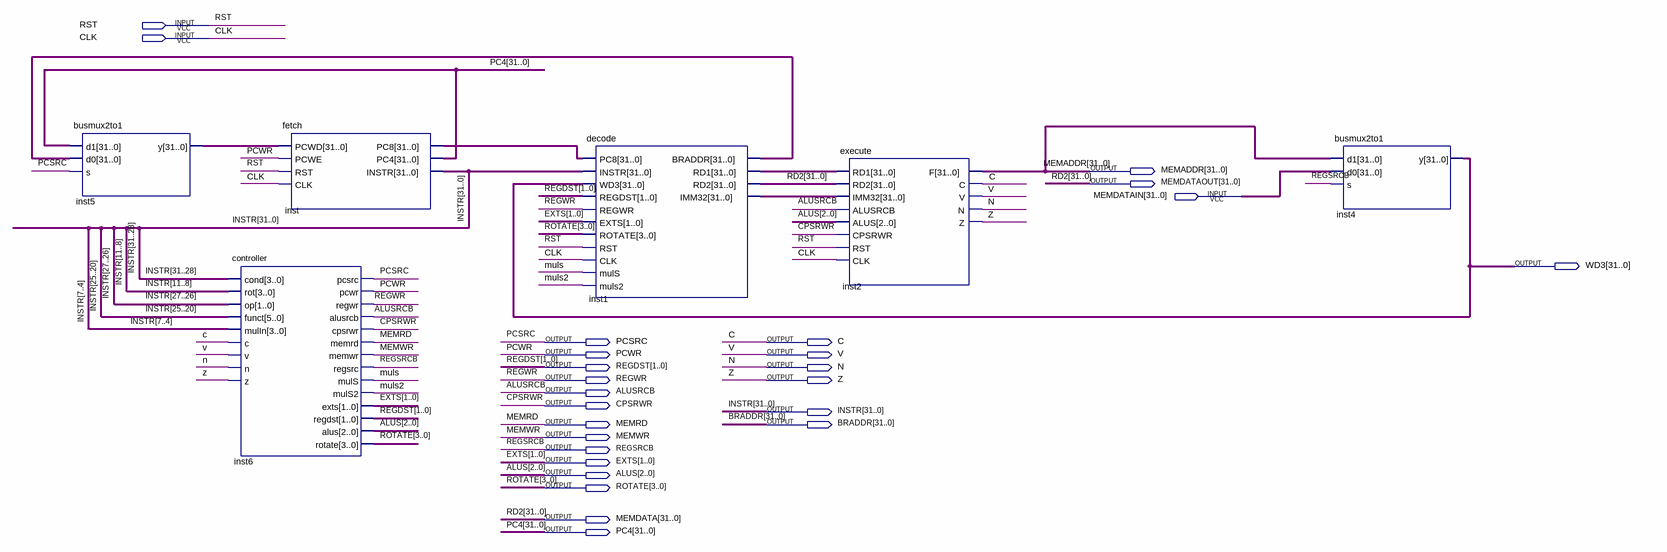
[diagram p0: schematic sheet]
// Quartus schematic scp.bdf as structural Verilog: 6 symbols, 26 pins
module scp (
  input  RST,
  input  CLK,
  input  [31:0] MEMDATAIN,
  output [31:0] MEMADDR,
  output [31:0] MEMDATAOUT,
  output [31:0] WD3,
  output PCSRC,
  output C,
  output PCWR,
  output V,
  output [1:0] REGDST,
  output N,
  output REGWR,
  output Z,
  output ALUSRCB,
  output CPSRWR,
  output [31:0] INSTR,
  output MEMRD,
  output [31:0] BRADDR,
  output MEMWR,
  output REGSRCB,
  output [1:0] EXTS,
  output [2:0] ALUS,
  output [3:0] ROTATE,
  output [31:0] MEMDATA,
  output [31:0] PC4
);

  wire muls, muls2;
  wire [31:0] inst1_braddr, inst1_imm32, inst1_rd1, inst5_y, inst_pc8;

  busmux2to1 inst5 (.d1(PC4), .d0(inst1_braddr), .s(PCSRC), .y(inst5_y));
  controller inst6 (
    .cond(INSTR[31:28]), .rot(INSTR[11:8]), .op(INSTR[27:26]), .funct(INSTR[25:20]), .mulIn(INSTR[7:4]),
    .c(C), .v(V), .n(N), .z(Z), .pcsrc(PCSRC), .pcwr(PCWR), .regwr(REGWR), .alusrcb(ALUSRCB),
    .cpsrwr(CPSRWR), .memrd(MEMRD), .memwr(MEMWR), .regsrc(REGSRCB), .mulS(muls), .mulS2(muls2), .exts(EXTS),
    .regdst(REGDST), .alus(ALUS), .rotate(ROTATE));
  fetch inst (.PCWD(inst5_y), .PCWE(PCWR), .RST(RST), .CLK(CLK), .PC8(inst_pc8), .PC4(PC4), .INSTR(INSTR));
  decode inst1 (
    .PC8(inst_pc8), .INSTR(INSTR), .WD3(WD3), .REGDST(REGDST), .REGWR(REGWR), .EXTS(EXTS), .ROTATE(ROTATE),
    .RST(RST), .CLK(CLK), .mulS(muls), .muls2(muls2), .BRADDR(inst1_braddr), .RD1(inst1_rd1), .RD2(MEMDATA),
    .IMM32(inst1_imm32));
  execute inst2 (
    .RD1(inst1_rd1), .RD2(MEMDATA), .IMM32(inst1_imm32), .ALUSRCB(ALUSRCB), .ALUS(ALUS), .CPSRWR(CPSRWR),
    .RST(RST), .CLK(CLK), .F(MEMADDR), .C(C), .V(V), .N(N), .Z(Z));
  busmux2to1 inst4 (.d1(MEMADDR), .d0(MEMDATAIN), .s(REGSRCB), .y(WD3));

  assign MEMDATAOUT = MEMDATA;

  // Other names for the same wires on the sheet: RD2[31:0] = MEMDATA
endmodule
